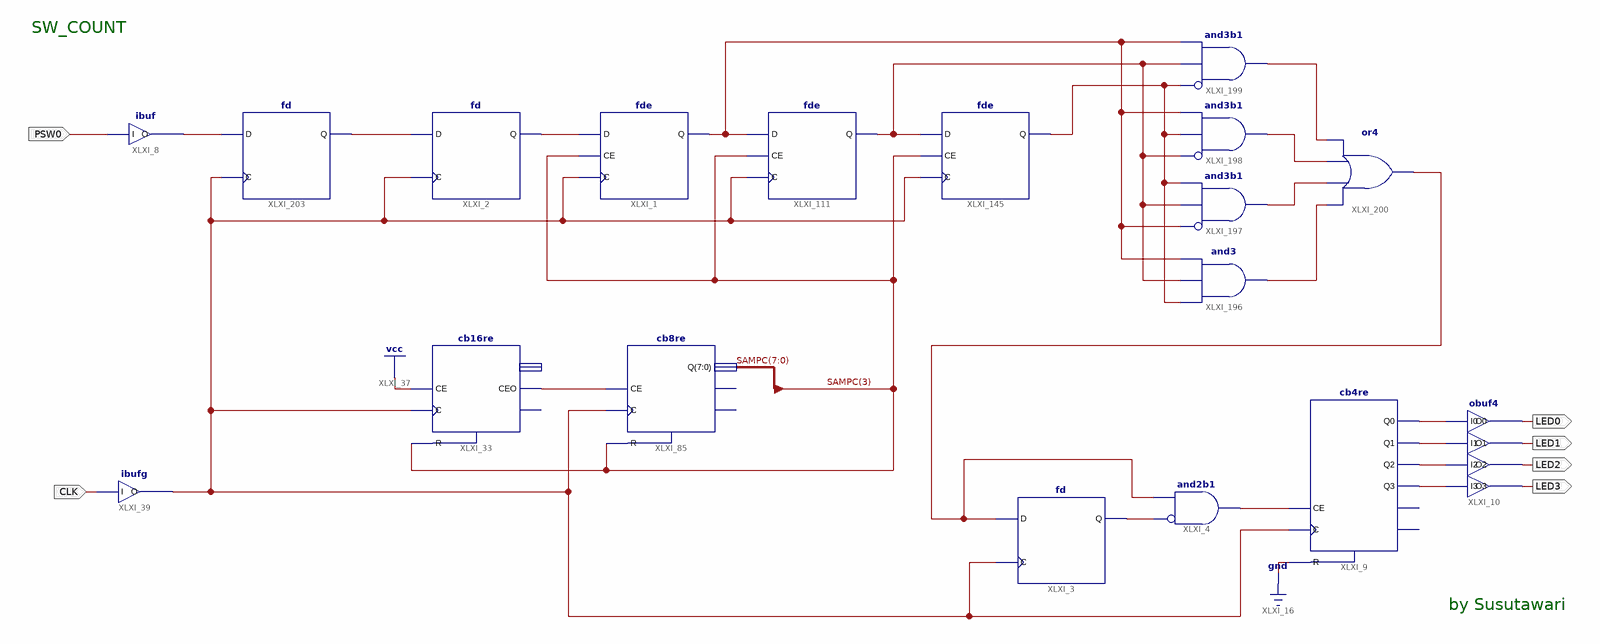
[diagram p0: schematic sheet 1]
// Xilinx ISE schematic SW_COUNT.sch (spartan3e) as structural Verilog: 18 symbols, 6 ports
module SW_COUNT (
  input  PSW0,
  input  CLK,
  output LED0,
  output LED1,
  output LED2,
  output LED3
);

  wire IO6, LA_CLK, XLXN_1, XLXN_151, XLXN_554, XLXN_773, XLXN_774, XLXN_775, XLXN_776, XLXN_782, XLXN_797,
       XLXN_913, XLXN_945, XLXN_972, XLXN_973, XLXN_974, XLXN_975, XLXN_1204, XLXN_1205;
  wire [7:0] SAMPC;

  fd XLXI_2 (.C(LA_CLK), .D(XLXN_1204), .Q(XLXN_782));
  fde XLXI_1 (.C(LA_CLK), .CE(SAMPC[3]), .D(XLXN_782), .Q(XLXN_913));
  cb16re XLXI_33 (.C(LA_CLK), .CE(1'b1), .R(SAMPC[3]), .CEO(XLXN_151));  // open: Q, TC
  cb8re XLXI_85 (.C(LA_CLK), .CE(XLXN_151), .R(SAMPC[3]), .Q(SAMPC));  // open: CEO, TC
  fde XLXI_145 (.C(LA_CLK), .CE(SAMPC[3]), .D(XLXN_797), .Q(XLXN_945));
  fde XLXI_111 (.C(LA_CLK), .CE(SAMPC[3]), .D(XLXN_913), .Q(XLXN_797));
  or XLXI_200 (XLXN_554, XLXN_776, XLXN_775, XLXN_774, XLXN_773);
  and XLXI_199 (XLXN_773, ~XLXN_945, XLXN_797, XLXN_913);  // and3b1
  and XLXI_198 (XLXN_774, ~XLXN_797, XLXN_945, XLXN_913);  // and3b1
  and XLXI_197 (XLXN_775, ~XLXN_913, XLXN_797, XLXN_945);  // and3b1
  and XLXI_196 (XLXN_776, XLXN_945, XLXN_797, XLXN_913);
  fd XLXI_3 (.C(LA_CLK), .D(XLXN_554), .Q(XLXN_1));
  and XLXI_4 (IO6, ~XLXN_1, XLXN_554);  // and2b1
  cb4re XLXI_9 (
    .C(LA_CLK), .CE(IO6), .R(1'b0), .Q0(XLXN_972), .Q1(XLXN_973), .Q2(XLXN_974), .Q3(XLXN_975));  // open: CEO, TC
  obuf4 XLXI_10 (
    .I0(XLXN_972), .I1(XLXN_973), .I2(XLXN_974), .I3(XLXN_975), .O0(LED0), .O1(LED1), .O2(LED2), .O3(LED3));
  fd XLXI_203 (.C(LA_CLK), .D(XLXN_1205), .Q(XLXN_1204));
  ibuf XLXI_8 (.I(PSW0), .O(XLXN_1205));
  ibufg XLXI_39 (.I(CLK), .O(LA_CLK));

  // Notes on the sheet:
  //   SW_COUNT
  //   by Susutawari
endmodule
